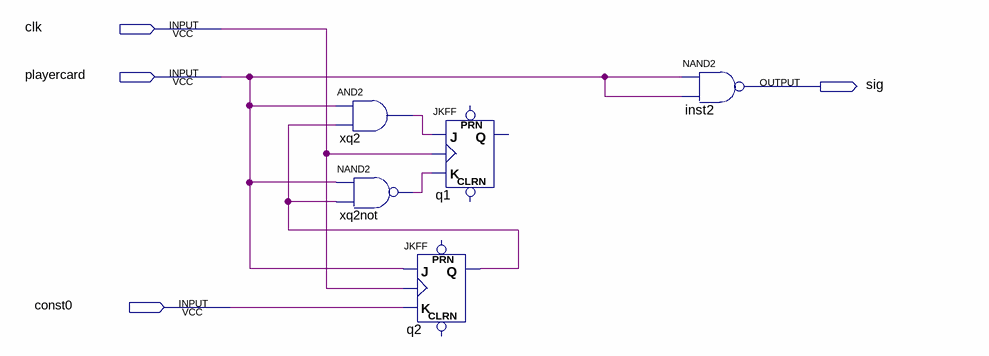
[diagram p0: schematic sheet]
// Quartus schematic cardsaver.bdf as structural Verilog: 5 symbols, 4 pins
module cardsaver (
  input  clk,
  input  playercard,
  input  const0,
  output sig
);

  wire q2_q, xq2_out, xq2not_out;

  and xq2 (xq2_out, playercard, q2_q);
  nand xq2not (xq2not_out, playercard, q2_q);
  JKFF q2 (.K(const0), .J(playercard), .CLK(clk), .Q(q2_q));  // open: PRN, CLRN
  JKFF q1 (.K(xq2not_out), .J(xq2_out), .CLK(clk));  // open: PRN, CLRN, Q
  nand inst2 (sig, playercard, playercard);
endmodule
